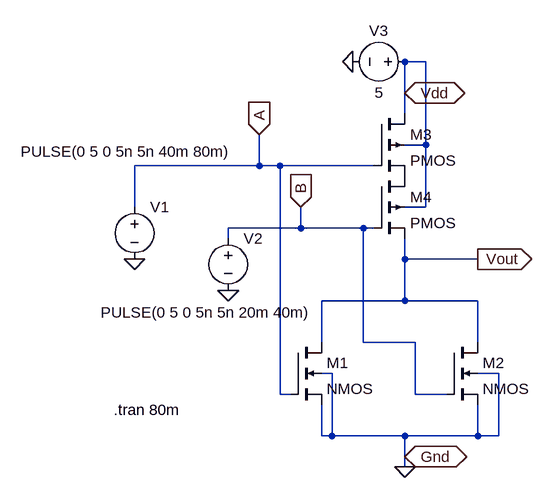
[diagram p0: schematic NOR.asc]
NOR.asc, the LTspice schematic file:
Version 4.1
SHEET 1 880 680
WIRE 352 -272 320 -272
WIRE 320 -224 320 -272
WIRE 320 -192 320 -224
WIRE 352 -144 352 -272
WIRE 352 -144 320 -144
WIRE 96 -112 96 -160
WIRE 96 -112 -96 -112
WIRE 128 -112 96 -112
WIRE 272 -112 128 -112
WIRE -96 -48 -96 -112
WIRE 352 -48 352 -144
WIRE 352 -48 320 -48
WIRE 160 -16 160 -48
WIRE 160 -16 48 -16
WIRE 256 -16 160 -16
WIRE 272 -16 256 -16
WIRE 48 0 48 -16
WIRE 320 32 320 0
WIRE 432 32 320 32
WIRE 320 96 320 32
WIRE 320 96 192 96
WIRE 432 96 320 96
WIRE 192 160 192 96
WIRE 256 160 256 -16
WIRE 336 160 256 160
WIRE 432 160 432 96
WIRE 208 208 192 208
WIRE 464 208 432 208
WIRE 128 240 128 -112
WIRE 144 240 128 240
WIRE 336 240 336 160
WIRE 384 240 336 240
WIRE 192 304 192 256
WIRE 208 304 208 208
WIRE 208 304 192 304
WIRE 320 304 208 304
WIRE 432 304 432 256
WIRE 432 304 320 304
WIRE 464 304 464 208
WIRE 464 304 432 304
WIRE 320 336 320 304
WIRE 320 352 320 336
FLAG 48 80 0
FLAG -96 32 0
FLAG 240 -272 0
FLAG 432 32 Vout
IOPIN 432 32 Out
FLAG 96 -160 A
IOPIN 96 -160 In
FLAG 160 -48 B
IOPIN 160 -48 In
FLAG 320 -224 Vdd
IOPIN 320 -224 BiDir
FLAG 320 352 0
FLAG 320 336 Gnd
IOPIN 320 336 BiDir
SYMBOL nmos4 144 160 R0
SYMATTR InstName M1
SYMBOL nmos4 384 160 R0
SYMATTR InstName M2
SYMBOL pmos4 272 -192 R0
SYMATTR InstName M3
SYMBOL pmos4 272 -96 R0
SYMATTR InstName M4
SYMBOL voltage -96 -64 R0
WINDOW 3 -175 -70 Left 2
WINDOW 123 0 0 Left 0
WINDOW 39 0 0 Left 0
SYMATTR Value PULSE(0 5 0 5n 5n 40m 80m)
SYMATTR InstName V1
SYMBOL voltage 48 -16 R0
WINDOW 3 -196 130 Left 2
WINDOW 123 0 0 Left 0
WINDOW 39 0 0 Left 0
SYMATTR Value PULSE(0 5 0 5n 5n 20m 40m)
SYMATTR InstName V2
SYMBOL voltage 336 -272 R90
WINDOW 0 -32 56 VBottom 2
WINDOW 3 32 56 VTop 2
WINDOW 123 0 0 Left 0
WINDOW 39 0 0 Left 0
SYMATTR InstName V3
SYMATTR Value 5
TEXT -128 264 Left 2 !.tran 80m

The netlist it stands for:
* NOR.asc
M1 Vout A 0 0 NMOS
M2 Vout B 0 0 NMOS
M3 Vdd A P001 Vdd PMOS
M4 P001 B Vout Vdd PMOS
V1 A 0 PULSE(0 5 0 5n 5n 40m 80m)
V2 B 0 PULSE(0 5 0 5n 5n 20m 40m)
V3 Vdd 0 5
.model NMOS NMOS
.model PMOS PMOS
.lib standard.mos
.tran 80m
.backanno
.end